# Altium project uPre V2.PrjPcb
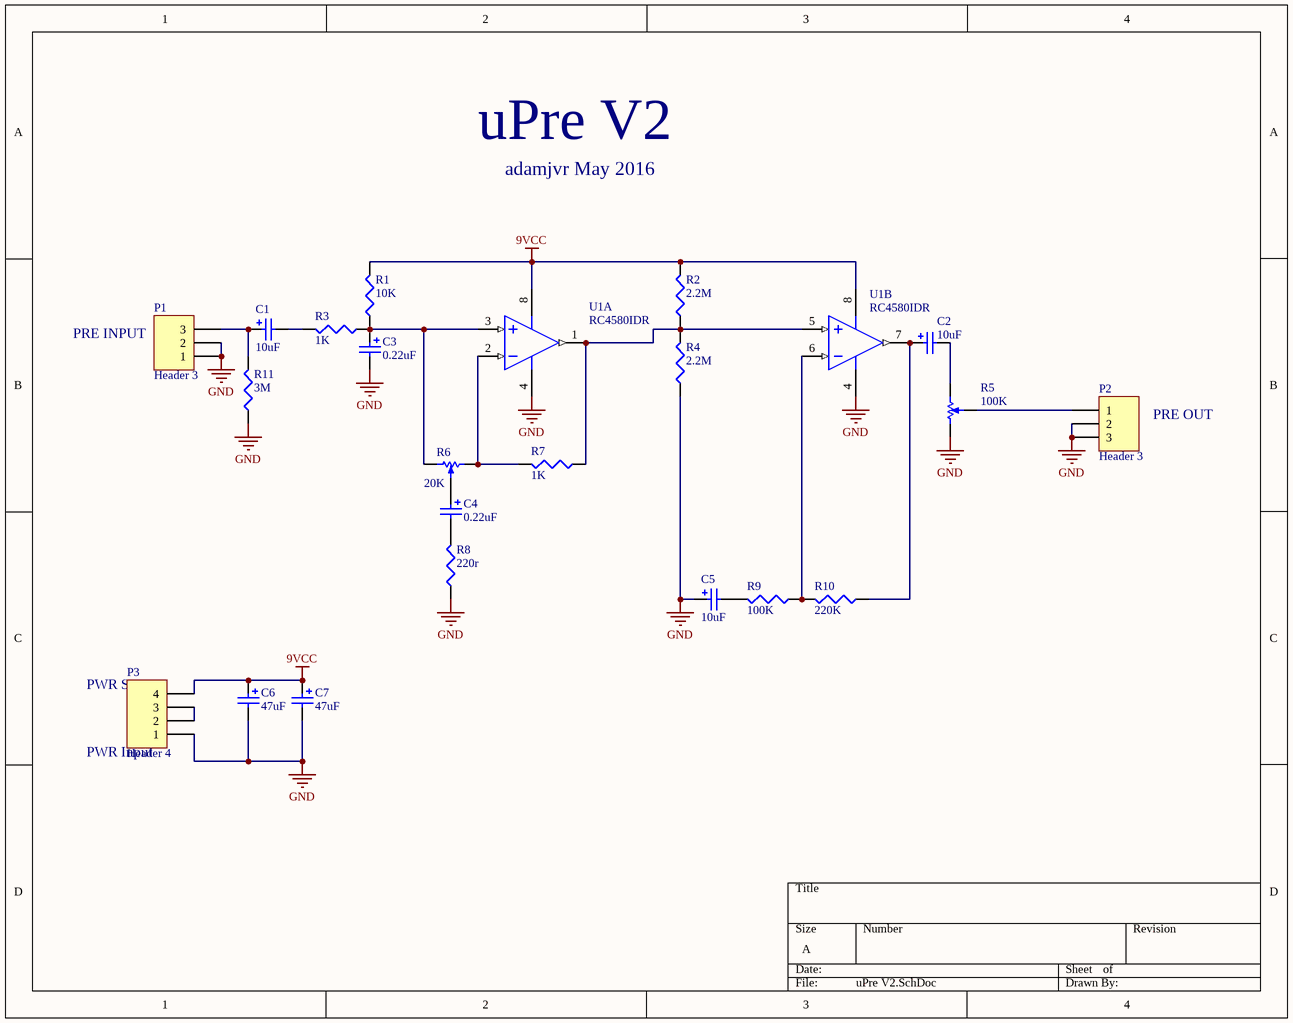
[diagram p0: uPre V2.SchDoc]
1 sheet, 22 parts. Net scope: global (net labels, ports and power ports of the same name join across sheets).
Board file: uPre V2.PcbDoc

## Sheet uPre V2.SchDoc
size A

### Parts
C1  10uF  [4X6mmCAP]
C2  10uF  [4X6mmCAP]
C3  0.22uF  [4X6mmCAP]
C4  0.22uF  [4X6mmCAP]
C5  10uF  [4X6mmCAP]
C6  47uF  [5X12.5mmCAP - BLUE]
C7  47uF  [5X12.5mmCAP - BLUE]
P1  Header 3  [HDR1X3]
P2  Header 3  [HDR1X3]
P3  Header 4  [HDR1X4]
R1  10K  [R0805]
R2  2.2M  [R0805]
R3  1K  [R0805]
R4  2.2M  [R0805]
R5  100K  [BOURNS_PTD90SERIES_POT]
R6  20K  [BOURNS_PTD90SERIES_POT]
R7  1K  [R0805]
R8  220r  [R0805]
R9  100K  [R0805]
R10  220K  [R0805]
R11  3M  [R0805]
U1  RC4580IDR  [SOIC127P600X175-8N]  (parts A,B of 2)

### Nets
9VCC: C6.1 C7.1 P3.4 R1.2 R2.2 U1.8(V+)
GND: C3.2 C5.1 C6.2 C7.2 P1.1 P1.2 P2.2 P2.3 P3.1 R4.1 R5.3 R8.1 R11.1 U1.4(V-)
NetC1_1: C1.1 P1.3 R11.2
NetC1_2: C1.2 R3.2
NetC2_1: C2.1 R10.1 U1.7(OUT_B)
NetC2_2: C2.2 R5.1
NetC3_1: C3.1 R1.1 R3.1 R6.3 U1.3(IN_A)
NetC4_1: C4.1 R6.2
NetC4_2: C4.2 R8.2
NetC5_2: C5.2 R9.2
NetP2_1: P2.1 R5.2
NetP3_2: P3.2 P3.3
NetR2_1: R2.1 R4.2 R7.1 U1.1(OUT_A) U1.5(IN_B)
NetR6_1: R6.1 R7.2 U1.2(IN_A)
NetR9_1: R9.1 R10.2 U1.6(IN_B)

### Notes on the sheet
- uPre V2
- adamjvr May 2016
- PRE INPUT
- PRE OUT
- (near P3) PWR SW
- (near P3) PWR Input

### Library data of the parts
C1 C2 C5 = UMW1C100MDD1TP: CAP ALUM 10UF 20% 16V RADIAL; MFR: Nichicon; Pin Count #: 2; Type: aluminum capacitor throughhole; Lead-Free ?: Yes; Designer: Adam Vadala-Roth; MFR #: UMW1C100MDD1TP; Status: Active; Mounting: Through hole; Datasheet: http://nichicon-us.com/english/products/pdfs/e-umw.pdf; Height: 6mm; Tolerance: 20%; Cost: 0.08766; Voltage: 16V; Date Created: 10 May 2016; Last Modified: 10 May 2016; Value: 10uF
C3 C4 = UMW1HR22MDD1TP: CAP ALUM 0.22UF 20% 50V RADIAL; MFR: Nichicon; Pin Count #: 2; Type: aluminum capacitor throughhole; Lead-Free ?: Yes; Designer: Adam Vadala-Roth; MFR #: UMW1HR22MDD1TP; Status: Active; Mounting: Through hole; Datasheet: http://nichicon-us.com/english/products/pdfs/e-umw.pdf; Height: 6mm; Tolerance: 20%; Cost: 0.08766; Voltage: 50V; Date Created: 11 May 2016; Last Modified: 11 May 2016; Value: 0.22uF
C6 C7 = UKA1E470MDD1TD: CAP ALUM 47UF 20% 25V RADIAL; MFR: Nichicon; Pin Count #: 2; Type: Aluminum Capacitor Radial Through hole; Lead-Free ?: Yes; Designer: Adam Vadala-Roth; MFR #: UKA1E470MDD1TD; Status: Active; Mounting: Through Hole; Datasheet: http://nichicon-us.com/english/products/pdfs/e-ufg.pdf; Height: 13mm; Tolerance: 20%; Cost: 0.11360 @ 2000; Voltage: 25V; Date Created: 11 May 2016; Last Modified: 11 May 2016; Value: 47uF
P1 P2 = Header 3: Header, 3-Pin; LatestRevisionDate: 17-Jul-2002; LatestRevisionNote: Re-released for DXP Platform.; Publisher: Altium Limited
P3 = Header 4: Header, 4-Pin; LatestRevisionDate: 17-Jul-2002; LatestRevisionNote: Re-released for DXP Platform.; Publisher: Altium Limited
R1 = ERJ-6ENF1002V: RES SMD 10K OHM 1% 1/8W 0805; MFR: Panasonic-Electronic-Components; Pin Count #: 2; Lead-Free ?: Yes; Designer: Adam Vadala-Roth; MFR #: ERJ-6ENF1002V; Status: Active; Mounting: SMT/SMD; Datasheet: http://industrial.panasonic.com/www-cgi/jvcr13pz.cgi?E+PZ+3+AOA0002+ERJ6ENF1002V+7+WW; Height: 0.7mm; Tolerance: 1%; Cost: 0.00729 @ 1000; Type: Chip Resistor 0805; Voltage: 1/8W; Date Created: 8 May 2016; Last Modified: 8 May 2016; Value: 10K
R2 R4 = RC2012F225CS: RES SMD 2.2M OHM 1% 1/8W 0805; MFR: Samsung-Electro-Mechanics-America,-Inc.; Pin Count #: 2; Lead-Free ?: Yes; Designer: Adam Vadala-Roth; MFR #: RC2012F225CS; Status: Active; Mounting: SMT/SMD; Datasheet: https://media.digikey.com/pdf/Data%20Sheets/Samsung%20PDFs/RC_Series_ds.pdf; Height: 0.60mm; Tolerance: 1%; Cost: 0.00289 @ 5000; Type: Chip Resistor 0805; Voltage: 1/8W; Date Created: 10 May 2016; Last Modified: 10 May 2016; Value: 2.2M
R3 R7 = RC2012F102CS: RES SMD 1K OHM 1% 1/8W 0805; MFR: Samsung-Electro-Mechanics-America,-Inc.; Pin Count #: 2; Lead-Free ?: Yes; Designer: Adam Vadala-Roth; MFR #: RC2012F102CS; Status: Active; Mounting: SMT/SMD; Datasheet: https://media.digikey.com/pdf/Data%20Sheets/Samsung%20PDFs/RC_Series_ds.pdf; Height: 0.6mm; Tolerance: 1%; Cost: 0.00408	 @ 1000; Type: Chip Resistor; Voltage: 1/8W; Date Created: 10 May 2016; Last Modified: 10 May 2016; Value: 1K
R5 = PTD901-2015K-B104: POT 100K OHM 1/20W CARBON LINEAR; MFR: Bourns Inc.; Pin Count #: 3; Tolerance: 20%; Lead-Free ?: Yes; Designer: Adam Vadala-Roth; MFR #: PTD901-2015K-B104; Status: Active; Mounting: Through Hole; Datasheet: http://www.bourns.com/docs/Product-Datasheets/PTD90.pdf; Height: 11mm; Cost: 0.91800	 @ 1000; Type: Throughhole Potentiometer; Voltage: 1/20W; Date Created: 10 May 2016; Last Modified: 10 May 2016; Value: 100K
R6 = PTD901-2015K-B203: POT 20K OHM 1/20W CARBON LINEAR; MFR: Bourns Inc.; Pin Count #: 3; Tolerance: 20%; Lead-Free ?: Yes; Designer: Adam Vadala-Roth; MFR #: PTD901-2015K-B203; Status: Active; Mounting: Through Hole; Datasheet: http://www.bourns.com/docs/Product-Datasheets/PTD90.pdf; Height: 11mm; Cost: 0.91800	 @ 1000; Type: Throughhole Potentiometer; Voltage: 1/20W; Date Created: 10 May 2016; Last Modified: 10 May 2016; Value: 20K
R8 = RC2012F221CS: RES SMD 220 OHM 1% 1/8W 0805; MFR: Samsung-Electro-Mechanics-America,-Inc.; Pin Count #: 2; Tolerance: 5%; Lead-Free ?: Yes; Designer: Adam Vadala-Roth; MFR #: RC2012F221CS; Status: Active; Mounting: SMT/SMD; Datasheet: https://media.digikey.com/pdf/Data%20Sheets/Samsung%20PDFs/RC_Series_ds.pdf; Height: 0.60mm; Cost: 0.00408	 @ 1000; Type: Chip Resistor 0805; Voltage: 1/8W; Date Created: 11 May 2016; Last Modified: 11 May 2016; Value: 220r
R9 = ERJ-6ENF1003V: RES SMD 100K OHM 1% 1/8W 0805; MFR: Panasonic-Electronic-Components; Pin Count #: 2; Lead-Free ?: Yes; Designer: Adam Vadala-Roth; MFR #: ERJ-6ENF1003V; Status: Active; Mounting: SMT/SMD; Datasheet: http://industrial.panasonic.com/www-cgi/jvcr13pz.cgi?E+PZ+3+AOA0002+ERJ6ENF1003V+7+WW; Height: 0.7mm; Tolerance: 1%; Cost: 0.00729 @ 1000; Type: Chip Resistor; Voltage: 1/8W; Date Created: 9 May 2016; Last Modified: 9 May 2016; Value: 100K
R10 = RC2012F224CS: RES SMD 220K OHM 1% 1/8W 0805; MFR: Samsung-Electro-Mechanics-America,-Inc.; Pin Count #: 2; Lead-Free ?: Yes; Designer: Adam Vadala-Roth; MFR #: RC2012F224CS; Status: Active; Mounting: SMT/SMD; Datasheet: https://media.digikey.com/pdf/Data%20Sheets/Samsung%20PDFs/RC_Series_ds.pdf; Height: 0.60mm; Tolerance: 1%; Cost: 0.00266 @ 5000; Type: Chip Resistor 0805; Voltage: 1/8W; Date Created: 11 May 2016; Last Modified: 11 May 2016; Value: 220K
R11 = RC2012F305CS: RES SMD 3M OHM 1% 1/8W 0805; MFR: Samsung-Electro-Mechanics-America,-Inc.; Pin Count #: 2; Lead-Free ?: Yes; Designer: Adam Vadala-Roth; MFR #: RC2012F305CS; Status: Active; Mounting: SMT/SMD; Datasheet: https://media.digikey.com/pdf/Data%20Sheets/Samsung%20PDFs/RC_Series_ds.pdf; Height: 0.60mm; Tolerance: 1%; Cost: 0.00408 @ 1000; Type: Chip Resistor 0805; Voltage: 1/8W; Date Created: 10 May 2016; Last Modified: 10 May 2016; Value: 3M
U1 = RC4580IDR: IC OPAMP AUDIO 12MHZ 8SOIC Low Noise, High Performance, High Fidelity Dual Audio Operational Amplifier, 8-pin Narrow SOIC; MFR: Texas Instruments; Pin Count #: 8; Lead-Free ?: Yes; Voltage: 16V Max; Designer: Adam Vadala-Roth; MFR #: RC4580IDR; Status: Active; Mounting: SMT/SMD; Datasheet: http://www.ti.com/lit/ds/symlink/rc4580.pdf; Height: 1.2mm; Tolerance: N/A; Cost: 0.35000 @ 2500; Type: OPAMP IC, SOIC8 Package; Date Created: 10 May 2016; Last Modified: 10 May 2016